# Altium project differential_probe.PrjPcb
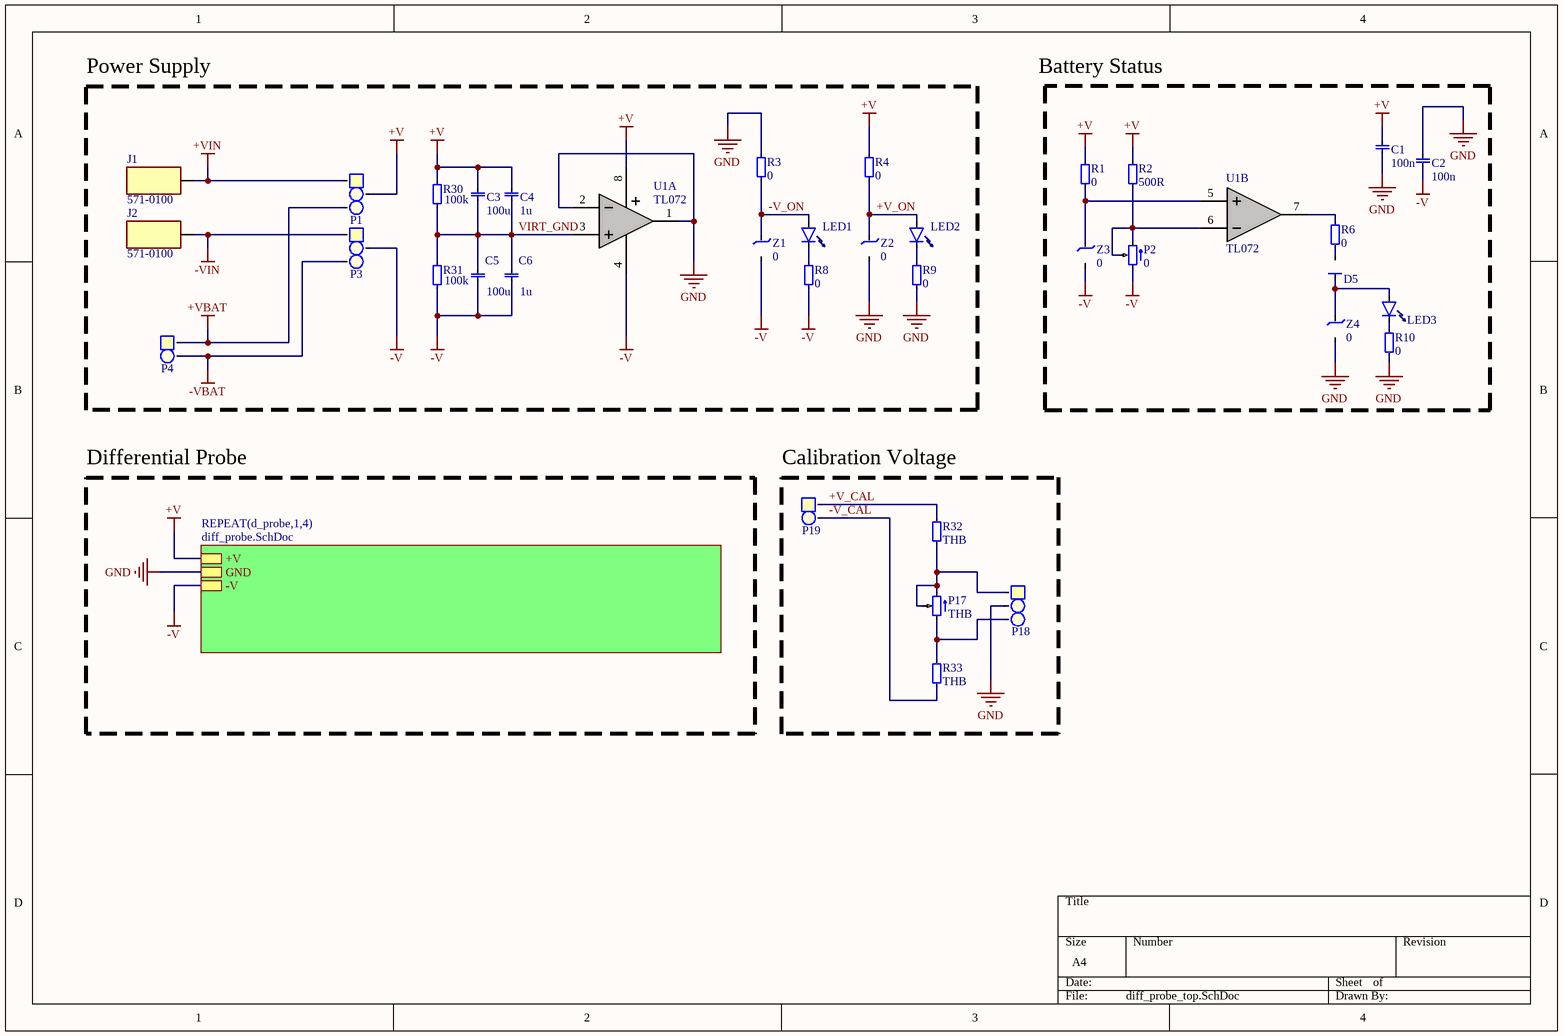
[diagram p0: diff_probe_top.SchDoc]
2 sheets, 260 parts. Net scope: hierarchical (ports join the sheet entries above them; power ports are global).
Board file: differential_probe.PcbDoc
Sheets:
  diff_probe_top.SchDoc
    d_probe1 = diff_probe.SchDoc
    d_probe2 = diff_probe.SchDoc
    d_probe3 = diff_probe.SchDoc
    d_probe4 = diff_probe.SchDoc

## Sheet diff_probe_top.SchDoc
size A4; SheetNumber: 1; SheetTotal: 2

### Parts
C1  value 100n  [0603 cap]  (hidden comment: 0603, capacitor)
C2  value 100n  [0603 cap]  (hidden comment: 0603, capacitor)
C3  value 100u  [1206, capasitor]  (hidden comment: 1206, capacitor)
C4  value 1u  [1206, capasitor]  (hidden comment: 1206, capacitor)
C5  value 100u  [1206, capasitor]  (hidden comment: 1206, capacitor)
C6  value 1u  [1206, capasitor]  (hidden comment: 1206, capacitor)
D5  Diode, SMD  [SOD323]  (value not drawn)
J1  571-0100  [Banana Conn VCC]
J2  571-0100  [Banana Conn GND]
LED1  0805, LED  [0805_led]  (value not drawn)
LED2  0805, LED  [0805_led]  (value not drawn)
LED3  0805, LED  [0805_led]  (value not drawn)
P1  1x3 Pin Header Mux  [padThree_L]  (value not drawn)
P2  value 0  [PV36W104C01B00]  (hidden comment: Pot)
P3  1x3 Pin Header Mux  [padThree_L]  (value not drawn)
P4  1x2 Pin Header  [padtwo_L]  (value not drawn)
P17  value THB  [PV36W104C01B00]  (hidden comment: Pot)
P18  1x3 Pin Header  [1x3_horizontal]  (value not drawn)
P19  1x2 Pin Header  [1x2 Bent]  (value not drawn)
R1  value 0  [0603]  (hidden comment: 0603, resistor)
R2  value 500R  [0603]  (hidden comment: 0603, resistor)
R3  value 0  [0603]  (hidden comment: 0603, resistor)
R4  value 0  [0603]  (hidden comment: 0603, resistor)
R6  value 0  [0603]  (hidden comment: 0603, resistor)
R8  value 0  [0603]  (hidden comment: 0603, resistor)
R9  value 0  [0603]  (hidden comment: 0603, resistor)
R10  value 0  [0603]  (hidden comment: 0603, resistor)
R30  value 100k  [0603]  (hidden comment: 0603, resistor)
R31  value 100k  [0603]  (hidden comment: 0603, resistor)
R32  value THB  [0603]  (hidden comment: 0603, resistor)
R33  value THB  [0603]  (hidden comment: 0603, resistor)
U1  TL072  [SOIC8]  (parts A,B of 2)
Z1  value 0  [DO-214AA]  (hidden comment: Zener Diode)
Z2  value 0  [DO-214AA]  (hidden comment: Zener Diode)
Z3  value 0  [DO-214AA]  (hidden comment: Zener Diode)
Z4  value 0  [DO-214AA]  (hidden comment: Zener Diode)

### Blocks framed on the sheet
Power Supply: C3-C6 J1 J2 LED1 LED2 P1 P3 P4 R3 R4 R8 R9 R30 R31 U1 Z1 Z2
Calibration Voltage: P17-P19 R32 R33

### Sub-sheets
REPEAT(d_probe,1,4) = diff_probe.SchDoc: GND, +V, -V

### Nets
+V: C1.1 C3.1 C4.1 P1.2 R1.0 R2.1 R4.0 R30.0 U1.8(V+) ; sheet REPEAT(d_probe,1,4)/+V
+VBAT: P1.3 P4.1
+VIN: J1.1 P1.1
-V: C2.1 C5.0 C6.0 P2.1 P3.2 R8.1 R31.1 U1.4(V-) Z1.1(Anode) Z3.1(Anode) ; sheet REPEAT(d_probe,1,4)/-V
-VBAT: P3.3 P4.2
-VIN: J2.1 P3.1
GND: C1.0 C2.0 P18.2 R3.0 R9.1 R10.1 U1.1(OUT1) U1.2(IN-) Z2.1(Anode) Z4.1(Anode) ; sheet REPEAT(d_probe,1,4)/GND
+V_CAL: P19.1 R32.0
+V_ON: LED2.1 R4.1 Z2.2(Cathode)
-V_CAL: P19.2 R33.1
-V_ON: LED1.1 R3.1 Z1.2(Cathode)
VIRT_GND: C3.0 C4.0 C5.1 C6.1 R30.1 R31.0 U1.3(IN+)
NetD5_1: D5.1 LED3.1 Z4.2(Cathode)
NetD5_2: D5.2 R6.1
NetLED1_0: LED1.0(Cathode) R8.0
NetLED2_0: LED2.0(Cathode) R9.0
NetLED3_0: LED3.0(Cathode) R10.0
NetP2_2: P2.2 P2.3 R2.0 U1.6(IN-)
NetP17_1: P17.1 P18.3 R33.0
NetP17_2: P17.2 P17.3 P18.1 R32.1
NetR1_1: R1.1 U1.5(IN+) Z3.2(Cathode)
NetR6_0: R6.0 U1.7(OUT2)

### Notes on the sheet
- Battery Status
- Differential Probe

### Library data of the parts
J1 J2 = Banana conn: Banana Connector 571-0100; Manufacturer_Name: Deltron; Datasheet Link: https://www.dem-uk.com/deltron-components/Data/Product_Downloads/deltron-571-0100-4mm-90deg-single-socket-data.pdf; Height: 12.4mm; Manufacturer_Part_Number: 571-0100; Mouser Part Number: 164-6218; Mouser Price/Stock: https://www.mouser.com/Search/Refine.aspx?Keyword=164-6218
LED1-LED3 = 0805, LED: Value: 0805 LED
P1 P3 = 1x3 Pin Header Mux: 2.54 mm; Value: 1x3 Pin Header
P4 P19 = 1x2 Pin Header: 2.54 mm, TH; Value: 1x2 Pin Header
P18 = 1x3 Pin Header: 2.54 mm; Value: 1x3 Pin Header
U1 = TL072: Dual FET-Input Operational Amplifier
C1 C2 = 0603, capacitor: Order number: *

## Sheet diff_probe.SchDoc
size A4; SheetNumber: 2; SheetTotal: 2
Used 4 times, as channels d_probe1, d_probe2, d_probe3, d_probe4. Parts and nets are listed once, with the designators drawn on the sheet.
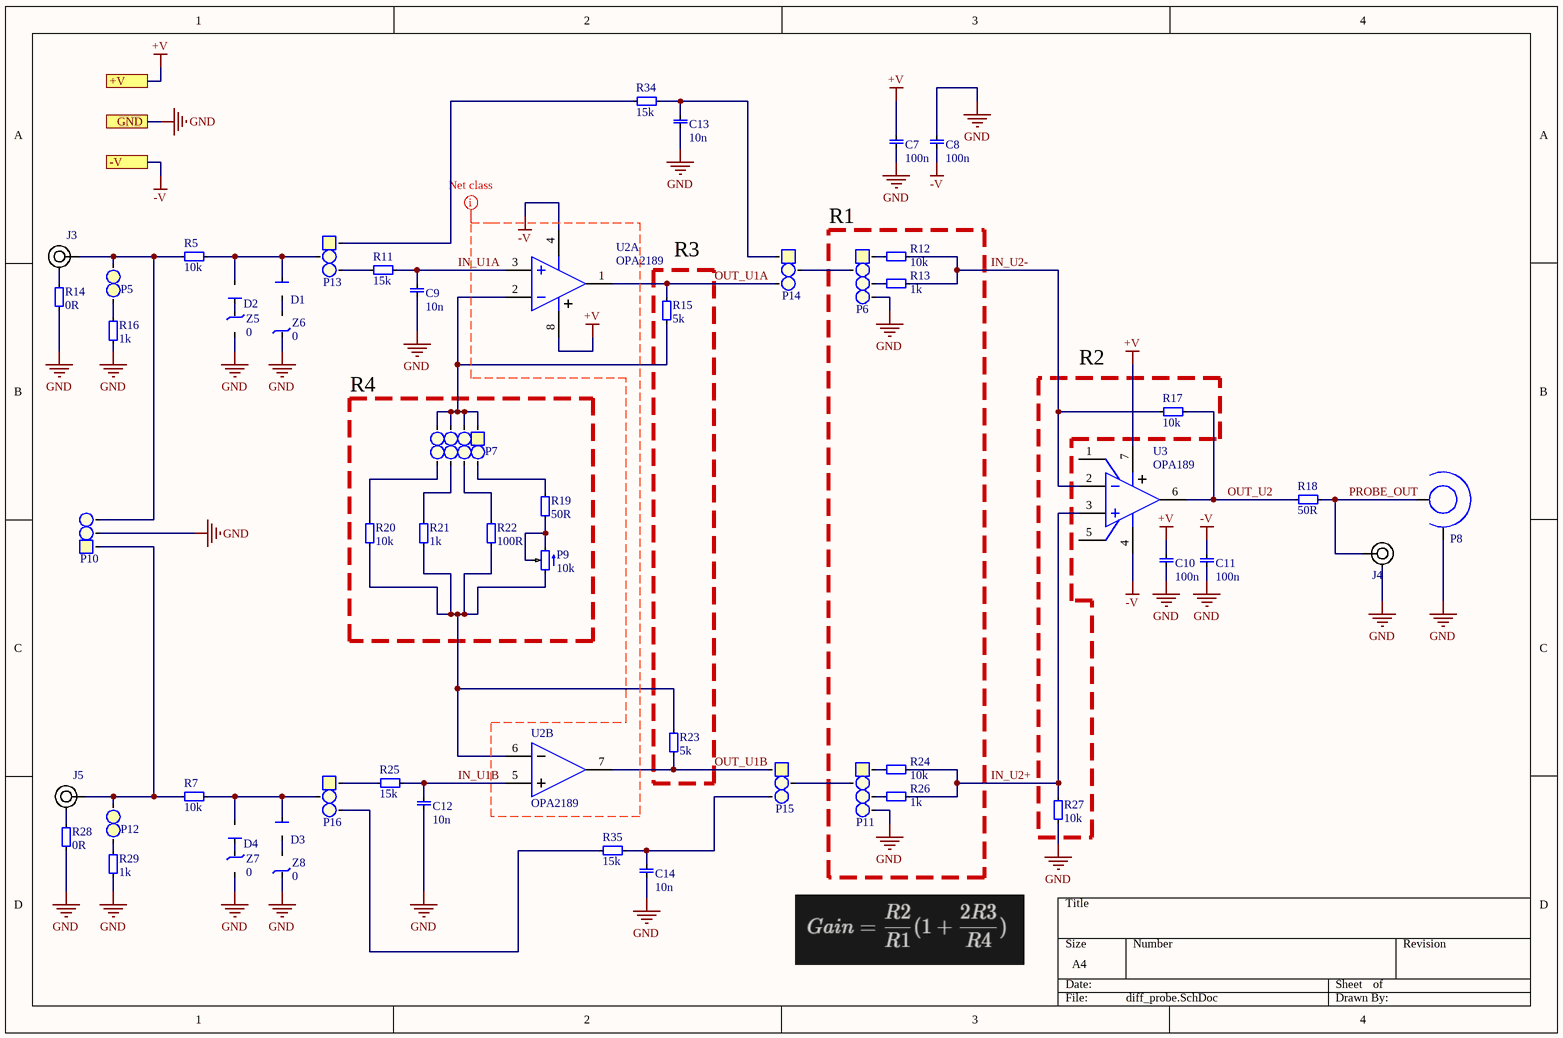
[diagram p1: diff_probe.SchDoc]

### Parts
C7  value 100n  [0603 cap]  (hidden comment: 0603, capacitor)
C8  value 100n  [0603 cap]  (hidden comment: 0603, capacitor)
C9  value 10n  [0603 cap]  (hidden comment: 0603, capacitor)
C10  value 100n  [0603 cap]  (hidden comment: 0603, capacitor)
C11  value 100n  [0603 cap]  (hidden comment: 0603, capacitor)
C12  value 10n  [0603 cap]  (hidden comment: 0603, capacitor)
C13  value 10n  [0603 cap]  (hidden comment: 0603, capacitor)
C14  value 10n  [0603 cap]  (hidden comment: 0603, capacitor)
D1  Diode, SMD  [SOD323]  (value not drawn)
D2  Diode, SMD  [SOD323]  (value not drawn)
D3  Diode, SMD  [SOD323]  (value not drawn)
D4  Diode, SMD  [SOD323]  (value not drawn)
J3  SMA H  [EMPCB.SMAFSTJ.C.HT]  (value not drawn)
J4  SMA H  [EMPCB.SMAFSTJ.C.HT]  (value not drawn)
J5  SMA H  [EMPCB.SMAFSTJ.C.HT]  (value not drawn)
P5  1x2 Pin Heade Straight  [padtwo_L]  (value not drawn)
P6  4x1 Pin Header  [padFour_L]  (value not drawn)
P7  2x4 Pin Header  [2X4 PH]  (value not drawn)
P8  BNC connector  [BNC_con]  (value not drawn)
P9  value 10k  [PV36W104C01B00]  (hidden comment: Pot)
P10  1x3 Pin Header  [1x3_horizontal]  (value not drawn)
P11  4x1 Pin Header  [padFour_L]  (value not drawn)
P12  1x2 Pin Heade Straight  [padtwo_L]  (value not drawn)
P13  1x3 Pin Header Mux  [padThree_L]  (value not drawn)
P14  1x3 Pin Header Mux  [padThree_L]  (value not drawn)
P15  1x3 Pin Header Mux  [padThree_L]  (value not drawn)
P16  1x3 Pin Header Mux  [padThree_L]  (value not drawn)
R5  value 10k  [2512, res]  (hidden comment: 2512, resistor)
R7  value 10k  [2512, res]  (hidden comment: 2512, resistor)
R11  value 15k  [0603]  (hidden comment: 0603, resistor)
R12  value 10k  [0603]  (hidden comment: 0603, resistor)
R13  value 1k  [0603]  (hidden comment: 0603, resistor)
R14  value 0R  [0603]  (hidden comment: 0603, resistor)
R15  value 5k  [0603]  (hidden comment: 0603, resistor)
R16  value 1k  [0603]  (hidden comment: 0603, resistor)
R17  value 10k  [0603]  (hidden comment: 0603, resistor)
R18  value 50R  [0603]  (hidden comment: 0603, resistor)
R19  value 50R  [0603]  (hidden comment: 0603, resistor)
R20  value 10k  [0603]  (hidden comment: 0603, resistor)
R21  value 1k  [0603]  (hidden comment: 0603, resistor)
R22  value 100R  [0603]  (hidden comment: 0603, resistor)
R23  value 5k  [0603]  (hidden comment: 0603, resistor)
R24  value 10k  [0603]  (hidden comment: 0603, resistor)
R25  value 15k  [0603]  (hidden comment: 0603, resistor)
R26  value 1k  [0603]  (hidden comment: 0603, resistor)
R27  value 10k  [0603]  (hidden comment: 0603, resistor)
R28  value 0R  [0603]  (hidden comment: 0603, resistor)
R29  value 1k  [0603]  (hidden comment: 0603, resistor)
R34  value 15k  [0603]  (hidden comment: 0603, resistor)
R35  value 15k  [0603]  (hidden comment: 0603, resistor)
U2  OPA2189  [SOIC8/SOT238]  (parts A,B of 2)
U3  OPA189  [SOIC8]
Z5  value 0  [SOT-23]  (hidden comment: Zener BZX84)
Z6  value 0  [SOT-23]  (hidden comment: Zener BZX84)
Z7  value 0  [SOT-23]  (hidden comment: Zener BZX84)
Z8  value 0  [SOT-23]  (hidden comment: Zener BZX84)

### Blocks framed on the sheet
R1: P6 P11 R12 R13 R24 R26
R3: R15 R23
R4: P7 P9 R19-R22
R2: R17 R27

### Ports
+V, -V, GND

### Nets
+V: C7.1 C10.1 U2.8(V+) U3.7(V+) ; port +V
-V: C8.1 C11.1 U2.4(V-) U3.4(V-) ; port -V
GND: C7.0 C8.0 C9.0 C10.0 C11.0 C12.0 C13.0 C14.0 J4.1 P6.4 P8.2 P10.2 P11.4 R14.1 R16.1 R27.1 R28.1 R29.1 Z5.1(Anode) Z6.3(Cathode) Z7.1(Anode) Z8.3(Cathode) ; port GND
IN_U1A: C9.1 R11.0 U2.3(IN+)
IN_U1B: C12.1 R25.0 U2.5(IN+)
IN_U2+: R24.0 R26.0 R27.0 U3.3(IN+)
IN_U2-: R12.0 R13.0 R17.1 U3.2(IN-)
OUT_U1A: P14.3 R15.1 U2.1(OUT1)
OUT_U1B: P15.1 R23.0 U2.7(OUT2)
OUT_U2: R17.0 R18.1 U3.6(OUT)
PROBE_OUT: J4.2 P8.1 R18.0
NetC13_1: C13.1 P14.1 R34.0
NetC14_1: C14.1 P15.3 R35.0
NetD1_1: D1.1 D2.2 P13.2 R5.1
NetD1_2: D1.2 Z6.1(Anode)
NetD2_1: D2.1 Z5.3(Cathode)
NetD3_1: D3.1 D4.2 P16.2 R7.1
NetD3_2: D3.2 Z8.1(Anode)
NetD4_1: D4.1 Z7.3(Cathode)
NetJ3_1: J3.1 R14.0
NetJ3_2: J3.2 P5.1 P10.3 R5.0
NetJ5_1: J5.1 R28.0
NetJ5_2: J5.2 P10.1 P12.1 R7.0
NetP5_2: P5.2 R16.0
NetP6_1: P6.1 R12.1
NetP6_2: P6.2 P14.2
NetP6_3: P6.3 R13.1
NetP7_1: P7.1 P7.2 P7.3 P7.4 R15.0 U2.2(IN-)
NetP7_5: P7.5 R20.1
NetP7_6: P7.6 R21.1
NetP7_7: P7.7 R22.1
NetP7_8: P7.8 R19.1
NetP9_1: P9.1 R20.0 R21.0 R22.0 R23.1 U2.6(IN-)
NetP9_2: P9.2 P9.3 R19.0
NetP11_1: P11.1 R24.1
NetP11_2: P11.2 P15.2
NetP11_3: P11.3 R26.1
NetP12_2: P12.2 R29.0
NetP13_1: P13.1 R34.1
NetP13_3: P13.3 R11.1
NetP16_1: P16.1 R25.1
NetP16_3: P16.3 R35.1

Not connected (* = marked no-connect by the designer): U3 1(OS_TRIM) 5(OS_TRIM)

### Channels
d_probe1: designators end in A; ports +V=+V -V=-V GND=GND
d_probe2: designators end in B; ports +V=+V -V=-V GND=GND
d_probe3: designators end in C; ports +V=+V -V=-V GND=GND
d_probe4: designators end in D; ports +V=+V -V=-V GND=GND

### Layout directives
net class sot-238: +V

### Library data of the parts
P5 P12 = 1x2 Pin Heade Straight: 2.54 mm, TH; Value: 1x2 Pin Header
P6 P11 = 1x4 Pin Header MUX: 2.54 mm; Value: 4x1 Pin Header
P7 = 2x4 Pin Header: 2.54mm,; Value: 2x8 Pin Header, 2.54mm, SMD
P10 = 1x3 Pin Header: 2.54 mm; Value: 1x3 Pin Header
P13-P16 = 1x3 Pin Header Mux: 2.54 mm; Value: 1x3 Pin Header
U2 = MAX44251: Dual FET-Input Operational Amplifier
U3 = TL071
C7-C14 = 0603, capacitor: Order number: *

## Nets that join several sheets
+V: diff_probe_top (9 pins), d_probe1 (C7A.1 C10A.1 U2A.8 U3A.7), d_probe2 (C7B.1 C10B.1 U2B.8 U3B.7), d_probe3 (C7C.1 C10C.1 U2C.8 U3C.7), d_probe4 (C7D.1 C10D.1 U2D.8 U3D.7)
-V: diff_probe_top (10 pins), d_probe1 (C8A.1 C11A.1 U2A.4 U3A.4), d_probe2 (C8B.1 C11B.1 U2B.4 U3B.4), d_probe3 (C8C.1 C11C.1 U2C.4 U3C.4), d_probe4 (C8D.1 C11D.1 U2D.4 U3D.4)
GND: diff_probe_top (10 pins), d_probe1 (22 pins), d_probe2 (22 pins), d_probe3 (22 pins), d_probe4 (22 pins)